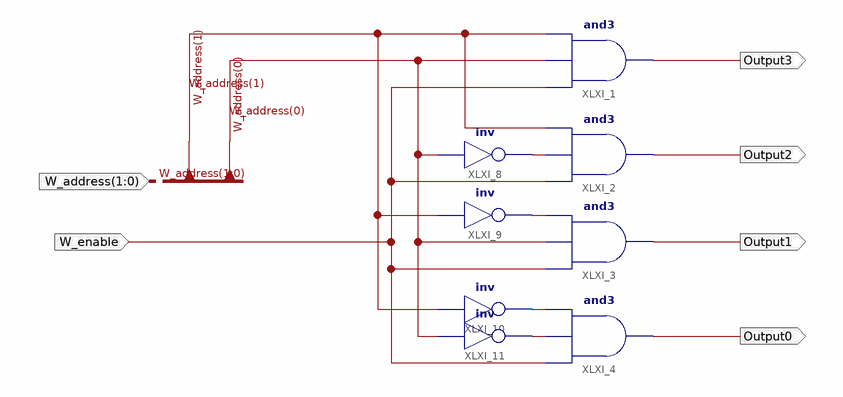
[diagram p0: schematic sheet 1]
// Xilinx ISE schematic proj2writeport.sch (spartan6) as structural Verilog: 8 symbols, 6 ports
module proj2writeport (
  input  [1:0] W_address,
  input  W_enable,
  output Output3,
  output Output2,
  output Output1,
  output Output0
);

  wire XLXN_19, XLXN_20, XLXN_21, XLXN_22;

  and XLXI_1 (Output3, W_enable, W_address[0], W_address[1]);
  and XLXI_2 (Output2, W_enable, XLXN_19, W_address[1]);
  and XLXI_3 (Output1, W_enable, W_address[0], XLXN_20);
  and XLXI_4 (Output0, W_enable, XLXN_22, XLXN_21);
  not XLXI_8 (XLXN_19, W_address[0]);
  not XLXI_9 (XLXN_20, W_address[1]);
  not XLXI_10 (XLXN_21, W_address[1]);
  not XLXI_11 (XLXN_22, W_address[0]);
endmodule
